# Altium schematic sheet sensors.SchDoc
size A4
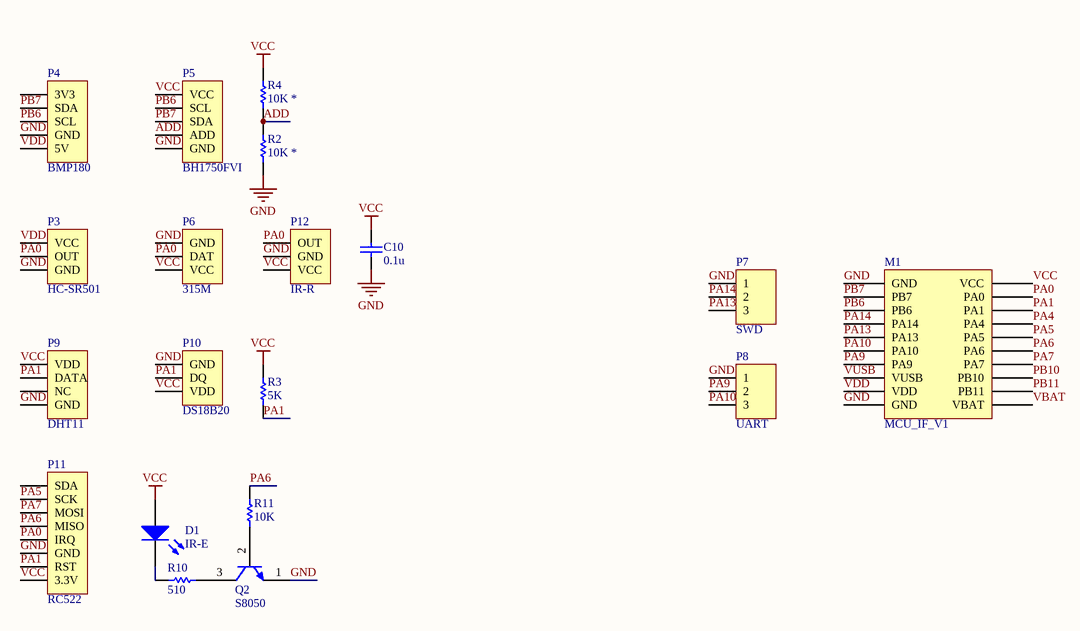
[diagram p0: sensors.SchDoc]

## Parts
C10  value 0.1u  [C-1608[0603]]  (hidden comment: Cap Semi)
D1  IR-E  [PIN2]
M1  MCU_IF_V1  [MCU_IF_V1]
P3  HC-SR501  [HDR1X3]
P4  BMP180  [HDR1X5]
P5  BH1750FVI  [HDR1X5]
P6  315M  [HDR1X3]
P7  SWD  [HDR1X3]
P8  UART  [HDR1X3]
P9  DHT11  [HDR1X4]
P10  DS18B20  [HDR1X3]
P11  RC522  [HDR1X8]
P12  IR-R  [HDR1X3]
Q2  S8050  [SOT23B]
R2  value 10K *  [R-1608[0603]]  (hidden comment: Res Semi)
R3  value 5K  [R-1608[0603]]  (hidden comment: Res Semi)
R4  value 10K *  [R-1608[0603]]  (hidden comment: Res Semi)
R10  value 510  [R-1608[0603]]  (hidden comment: Res Semi)
R11  value 10K  [R-1608[0603]]  (hidden comment: Res Semi)

## Nets
GND: C10.1 M1.1(GND) M1.10(GND) P3.3(GND) P4.4(GND) P5.5(GND) P6.1(GND) P7.1 P8.1 P9.4(GND) P10.1(GND) P11.6(GND) P12.2(GND) Q2.1(E) R2.2
VCC: C10.2 D1.1(A) M1.20(VCC) P5.1(VCC) P6.3(VCC) P9.1(VDD) P10.3(VDD) P11.8(3.3V) P12.3(VCC) R3.1 R4.1
ADD: P5.4(ADD) R2.1 R4.2
PA0: M1.19(PA0) P3.2(OUT) P6.2(DAT) P11.5(IRQ) P12.1(OUT)
PA1: M1.18(PA1) P9.2(DATA) P10.2(DQ) P11.7(RST) R3.2
PA4: M1.17(PA4)
PA5: M1.16(PA5) P11.2(SCK)
PA6: M1.15(PA6) P11.4(MISO) R11.2
PA7: M1.14(PA7) P11.3(MOSI)
PA9: M1.7(PA9) P8.2
PA10: M1.6(PA10) P8.3
PA13: M1.5(PA13) P7.3
PA14: M1.4(PA14) P7.2
PB6: M1.3(PB6) P4.3(SCL) P5.2(SCL)
PB7: M1.2(PB7) P4.2(SDA) P5.3(SDA)
PB10: M1.13(PB10)
PB11: M1.12(PB11)
VBAT: M1.11(VBAT)
VDD: M1.9(VDD) P3.1(VCC) P4.5(5V)
VUSB: M1.8(VUSB)
NetD1_2: D1.2(K) R10.1
NetQ2_2: Q2.2(B) R11.1
NetQ2_3: Q2.3(C) R10.2

Not connected (* = marked no-connect by the designer): P4 1(3V3); P9 3(NC); P11 1(SDA)

## Library data of the parts
C10 = Cap Semi: Capacitor (Semiconductor SIM Model); Published: 8-Jun-2000; LatestRevisionDate: 17-Jul-2002; LatestRevisionNote: Re-released for DXP Platform.; PackageReference: C1206; Publisher: Altium Limited
D1 = LED0: Typical INFRARED GaAs LED; Published: 8-Jun-2000; LatestRevisionDate: 08-Jul-2005; LatestRevisionNote: Mech Layer 1 removed.; PackageReference: LED-0; Publisher: Altium Limited
P3 = HC-SR501: Header, 3-Pin; LatestRevisionDate: 17-Jul-2002; LatestRevisionNote: Re-released for DXP Platform.; Publisher: Altium Limited
P4 = BMP180: Header, 5-Pin; LatestRevisionDate: 17-Jul-2002; LatestRevisionNote: Re-released for DXP Platform.; Publisher: Altium Limited
P6 = 315M: Header, 3-Pin; LatestRevisionDate: 17-Jul-2002; LatestRevisionNote: Re-released for DXP Platform.; Publisher: Altium Limited
P7 P8 = Header 3: Header, 3-Pin; LatestRevisionDate: 17-Jul-2002; LatestRevisionNote: Re-released for DXP Platform.; Publisher: Altium Limited
P9 = DHT11: Header, 4-Pin; LatestRevisionDate: 17-Jul-2002; LatestRevisionNote: Re-released for DXP Platform.; Publisher: Altium Limited
P10 = DS18B20: Header, 3-Pin; LatestRevisionDate: 17-Jul-2002; LatestRevisionNote: Re-released for DXP Platform.; Publisher: Altium Limited
P11 = RC522: Header, 8-Pin; LatestRevisionDate: 17-Jul-2002; LatestRevisionNote: Re-released for DXP Platform.; Publisher: Altium Limited
P12 = IR: Header, 3-Pin; LatestRevisionDate: 17-Jul-2002; LatestRevisionNote: Re-released for DXP Platform.; Publisher: Altium Limited
Q2 = 2N3904: NPN General Purpose Amplifier; pin to pad: 1>2 2>1; Published: 8-Jun-2000; LatestRevisionDate: 15-Jan-2003; LatestRevisionNote: PCB Footprint 'BCY-W3/D4.7' replaced; DatasheetDocument: 1997; PackageDocument: Sep-1998; PackageReference: TO-92A; Publisher: Altium Limited; Code_JEDEC: TO-92A; ComponentLink1Description: Manufacturer Link; ComponentLink1URL: http://www.fairchildsemi.com/; ComponentLink2Description: Datasheet; ComponentLink2URL: http://www.fairchildsemi.com/ds/2N%2F2N3904.pdf
R2-R4 R10 R11 = Res Semi: Semiconductor Resistor; Published: 8-Jun-2000; LatestRevisionDate: 17-Jul-2002; LatestRevisionNote: Re-released for DXP Platform.; PackageReference: AXIAL-0.5; Publisher: Altium Limited
P5 = BH1750FVI: LatestRevisionDate: 17-Jul-2002; LatestRevisionNote: Re-released for DXP Platform.; Publisher: Altium Limited